# EAGLE design Incubadora_huevos (EAGLE 7.6.0)
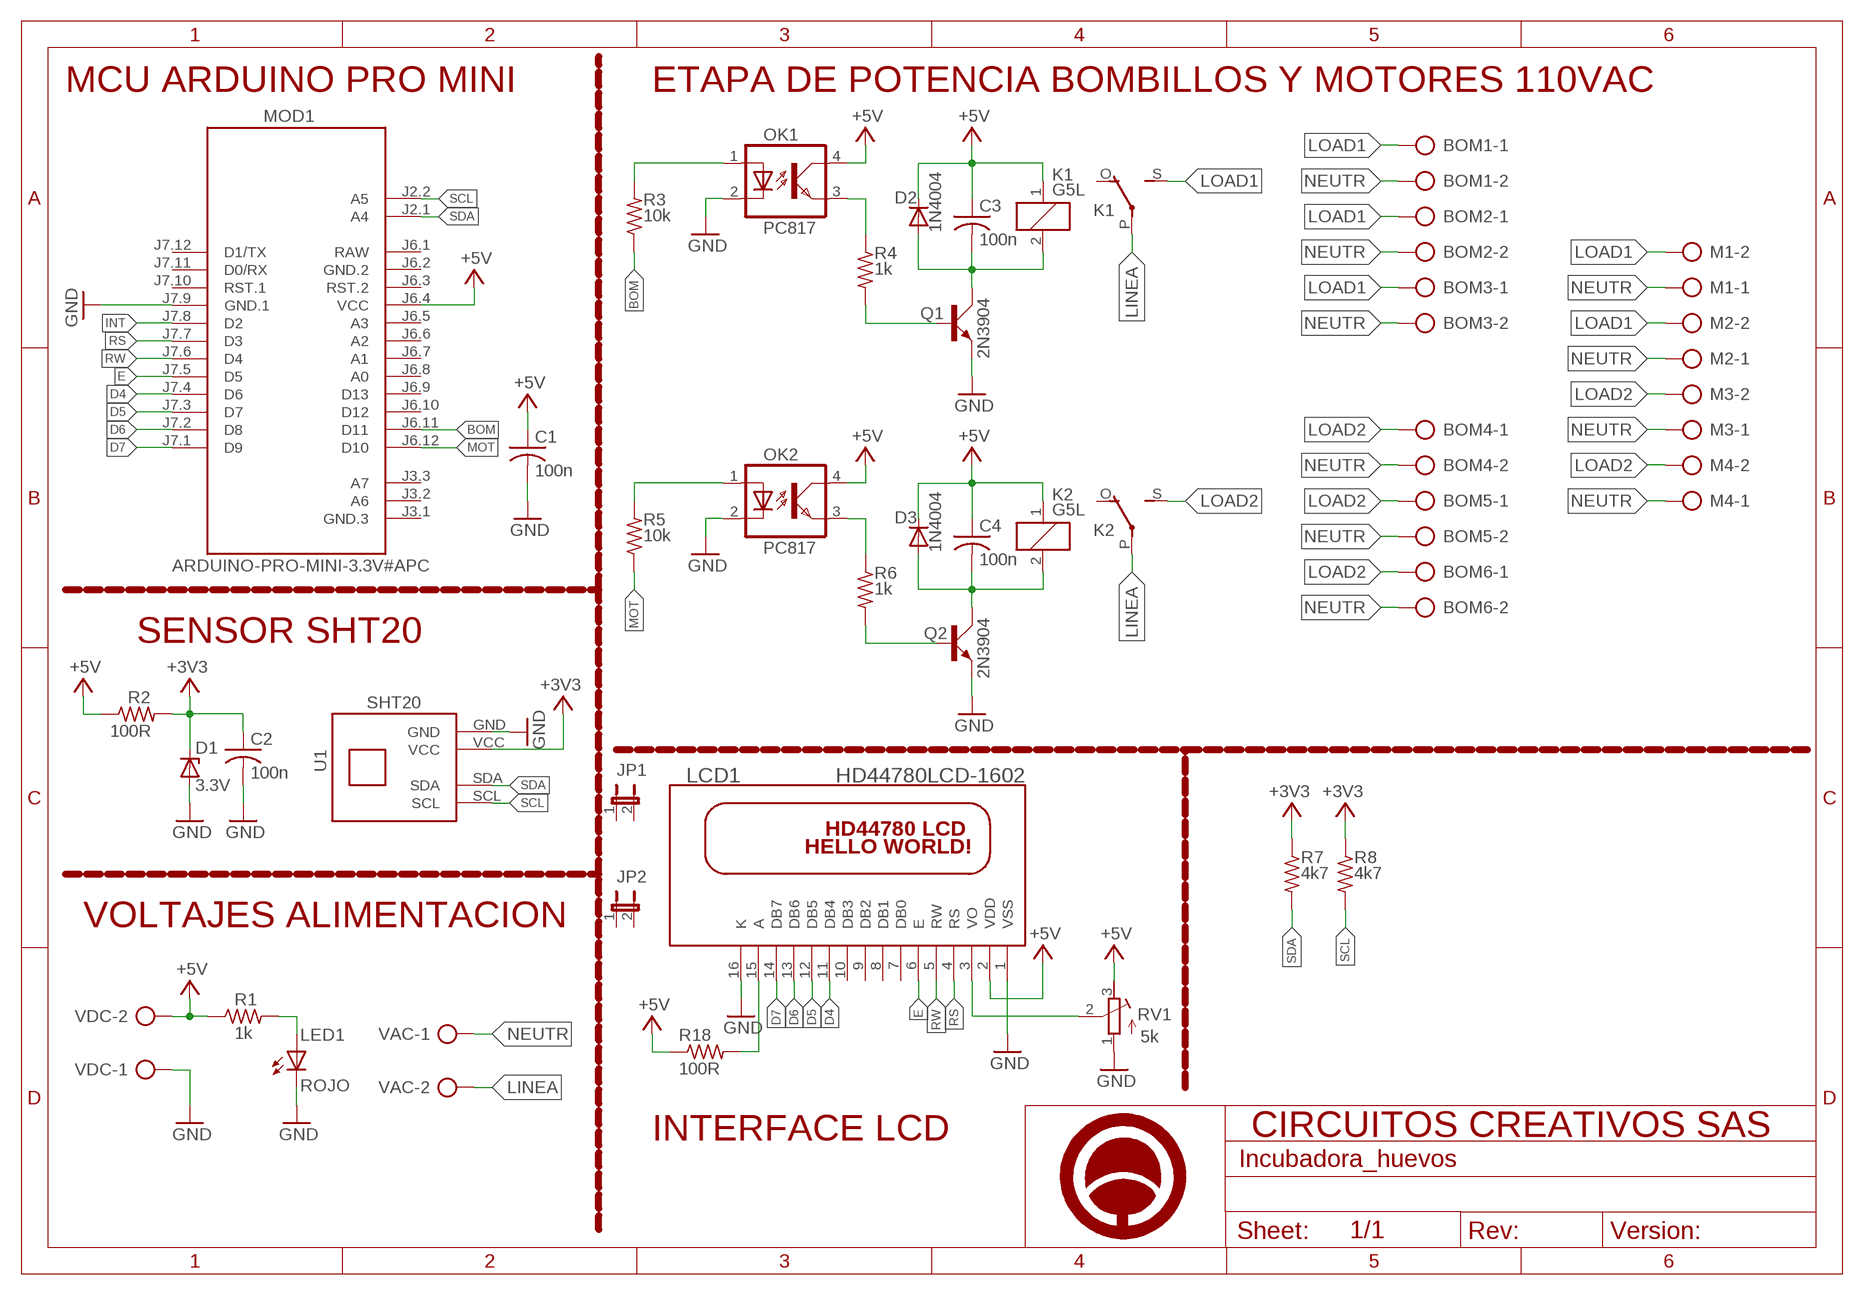
[diagram p0: schematic, sheet 1]

## Parts
BOM1  AK500/2  [AK500/2]
BOM2  AK500/2  [AK500/2]
BOM3  AK500/2  [AK500/2]
BOM4  AK500/2  [AK500/2]
BOM5  AK500/2  [AK500/2]
BOM6  AK500/2  [AK500/2]
C1  100n  C-US025-025X050  [C025-025X050]
C2  100n  C-US025-025X050  [C025-025X050]
C3  100n  C-US025-025X050  [C025-025X050]
C4  100n  C-US025-025X050  [C025-025X050]
D1  3.3V  ZENER-DIODEDO41Z10  [DO41Z10]
D2  1N4004  [DO41-10]
D3  1N4004  [DO41-10]
JP1  JP1E  [JP1]
JP2  JP1E  [JP1]
K1  G5L  [G5LE]
K2  G5L  [G5LE]
LCD1  HD44780LCD-1602  [LCD1602]
LED1  ROJO  LED3MM  [LED3MM]
M1  AK500/2  [AK500/2]
M2  AK500/2  [AK500/2]
M3  AK500/2  [AK500/2]
M4  AK500/2  [AK500/2]
MOD1  ARDUINO-PRO-MINI-3.3V#APC  [ARDUINO-PRO-MINI#APC]
OK1  PC817  [DIL04]
OK2  PC817  [DIL04]
Q1  2N3904  [TO92D]
Q2  2N3904  [TO92D]
R1  1k  R-US_0204/7  [0204/7]
R2  100R  R-US_0204/7  [0204/7]
R3  10k  R-US_0204/7  [0204/7]
R4  1k  R-US_0204/7  [0204/7]
R5  10k  R-US_0204/7  [0204/7]
R6  1k  R-US_0204/7  [0204/7]
R7  4k7  R-US_0204/7  [0204/7]
R8  4k7  R-US_0204/7  [0204/7]
R18  100R  R-US_0204/7  [0204/7]
RV1  5k  R-TRIMM3296W  [RTRIM3296W]
U1  SHT20  [SHT20]
U$1  A4_HORIZONTAL  [LOGO]
VAC  AK500/2  [AK500/2]
VDC  AK500/2  [AK500/2]

## Nets
+3V3: C2.1 D1.C R2.2 R7.1 R8.1 U1.VCC
+5V: C1.1 C3.1 C4.1 D2.C D3.C K1.1 K2.1 LCD1.2(VDD) MOD1.J6.4(VCC) OK1.4(COL) OK2.4(COL) R1.1 R2.1 R18.1 RV1.3(E) VDC.2
BOM: MOD1.J6.11(D11) R3.1
D4: LCD1.11(DB4) MOD1.J7.4(D6)
D5: LCD1.12(DB5) MOD1.J7.3(D7)
D6: LCD1.13(DB6) MOD1.J7.2(D8)
D7: LCD1.14(DB7) MOD1.J7.1(D9)
E: LCD1.6(E) MOD1.J7.5(D5)
GND: C1.2 C2.2 D1.A LCD1.1(VSS) LCD1.16(K) LED1.K(C) MOD1.J7.9(GND.1) OK1.2(C) OK2.2(C) Q1.E Q2.E RV1.1(A) U1.GND VDC.1
INT: MOD1.J7.8(D2)
LINEA: K1.P(2:P) K2.P(2:P) VAC.2
LOAD1: BOM1.1 BOM2.1 BOM3.1 K1.S(2:S) M1.2 M2.2
LOAD2: BOM4.1 BOM5.1 BOM6.1 K2.S(2:S) M3.2 M4.2
MOT: MOD1.J6.12(D10) R5.1
N$1: LED1.A R1.2
N$2: OK1.3(EMIT) R4.1
N$3: Q1.B R4.2
N$4: OK1.1(A) R3.2
N$5: C4.2 D3.A K2.2 Q2.C
N$6: OK2.3(EMIT) R6.1
N$7: Q2.B R6.2
N$8: OK2.1(A) R5.2
N$21: C3.2 D2.A K1.2 Q1.C
N$34: LCD1.3(VO) RV1.2(S)
N$46: LCD1.15(A) R18.2
NEUTR: BOM1.2 BOM2.2 BOM3.2 BOM4.2 BOM5.2 BOM6.2 M1.1 M2.1 M3.1 M4.1 VAC.1
RS: LCD1.4(RS) MOD1.J7.7(D3)
RW: LCD1.5(RW) MOD1.J7.6(D4)
SCL: MOD1.J2.2(A5) R8.2 U1.SCL
SDA: MOD1.J2.1(A4) R7.2 U1.SDA
Unconnected: JP1.1 JP1.2 JP2.1 JP2.2 K1.O(2:O) K2.O(2:O) LCD1.7(DB0) LCD1.8(DB1) LCD1.9(DB2) LCD1.10(DB3) MOD1.J3.1(GND.3) MOD1.J3.2(A6) MOD1.J3.3(A7) MOD1.J6.3(RST.2) MOD1.J6.5(A3) MOD1.J6.6(A2) MOD1.J6.7(A1) MOD1.J6.8(A0) MOD1.J6.9(D13) MOD1.J6.10(D12) MOD1.J7.10(RST.1) MOD1.J7.11(D0/RX) MOD1.J7.12(D1/TX)

## Notes on the sheet
- MCU ARDUINO PRO MINI | ETAPA DE POTENCIA BOMBILLOS Y MOTORES 110VAC
- SENSOR SHT20
- VOLTAJES ALIMENTACION
- INTERFACE LCD

## Power pins joined to a net without a drawn wire
GND.2: MOD1.J6.2(GND.2)
RAW: MOD1.J6.1(RAW)

## Library data of the parts
BOM1-BOM6 M1-M4 VAC VDC = con-ptr500:AK500/2: CONNECTOR; OC_FARNELL: unknown; OC_NEWARK: unknown
C1-C4 = rcl:C-US: CAPACITOR, American symbol
D1 = diode:ZENER-DIODE: Z-Diode
D2 D3 = adafruit:1N4004: DIODE General purpose 1N400x type rectifier (With bigger pads) http://www.ladyada.net/library/pcb/eaglelibrary.html
JP1 JP2 = jumper:JP1E: JUMPER
K1 K2 = relay:G5L: RELAY 1 x switch, 10 A/120 V AC, 8 A/30 V ADC, Omron; OC_FARNELL: unknown; OC_NEWARK: unknown
LCD1 = adafruit:HD44780LCD: HD44780 LCD Standard character type LCDs, available in sizes from 8x1 to 40x4!
LED1 = led:LED: LED OSRAM: - CHIPLED LG R971, LG N971, LY N971, LG Q971, LY Q971, LO R971, LY R971 LH N974, LH R974 LS Q976, LO Q976, LY Q976 LO Q996 - Hyper CHIPLED LW Q18S LB Q993, LB Q99A, LB R99A - SideLED LS A670, LO A670, LY A670, LG A670, LP A670 LB A673, LV A673, LT A673, LW A673 LH A674 LY A675 LS A676, LA A676, LO A676, LY A676, LW A676 LS A679, LY A679, LG A679 - Hyper Micro SIDELED® LS Y876, LA Y876, LO Y876, LY Y876 LT Y87S - SmartLED LW L88C, LW L88S LB L89C, LB L89S, LG L890 LS L89K, LO L89K, LY L89K LS L896, LA L896, LO L896, LY L896 - TOPLED LS T670, LO T670, LY T670, LG T670, LP T670 LSG T670, LSP T670, LSY T670, LOP T670, LYG T670 LG T671, LOG T671, LSG T671 LB T673, LV T673, LT T673, LW T673 LH T674 LS T676, LA T676, LO T676, LY T676, LB T676, LH T676, LSB T676, LW T676 LB T67C, LV T67C, LT T67C, LS T67K, LO T67K, LY T67K, LW E67C LS E67B, LA E67B, LO E67B, LY E67B, LB E67C, LV E67C, LT E67C LW T67C LS T679, LY T679, LG T679 LS T770, LO T770, LY T770, LG T770, LP T770 LB T773, LV T773, LT T773, LW T773 LH T774 LS E675, LA E675, LY E675, LS T675 LS T776, LA T776, LO T776, LY T776, LB T776 LHGB T686 LT T68C, LB T68C - Hyper Mini TOPLED® LB M676 - Mini TOPLED Santana® LG M470 LS M47K, LO M47K, LY M47K Source: http://www.osram.convergy.de LUXEON: - LUMILED® LXK2-PW12-R00, LXK2-PW12-S00, LXK2-PW14-U00, LXK2-PW14-V00 LXK2-PM12-R00, LXK2-PM12-S00, LXK2-PM14-U00 LXK2-PE12-Q00, LXK2-PE12-R00, LXK2-PE12-S00, LXK2-PE14-T00, LXK2-PE14-U00 LXK2-PB12-K00, LXK2-PB12-L00, LXK2-PB12-M00, LXK2-PB14-N00, LXK2-PB14-P00, LXK2-PB14-Q00 LXK2-PR12-L00, LXK2-PR12-M00, LXK2-PR14-Q00, LXK2-PR14-R00 LXK2-PD12-Q00, LXK2-PD12-R00, LXK2-PD12-S00 LXK2-PH12-R00, LXK2-PH12-S00 LXK2-PL12-P00, LXK2-PL12-Q00, LXK2-PL12-R00 Source: www.luxeon.com KINGBRIGHT: KA-3528ASYC Source: www.kingbright.com
MOD1 = DIY- comercial modules:ARDUINO-PRO-MINI-*#APC: Arduino Pro Mini (and compatible devices) with angle programming connector More details available here: https://www.arduino.cc/en/Main/ArduinoBoardProMini Click here to find device on ebay.com <http://www.ebay.com/sch/arduino+pro+mini>
OK1 OK2 = optocoupler:PC817: SHARP OPTO COUPLER; MPN: PC817X4J000F; OC_FARNELL: 9707727; OC_NEWARK: 97K7059
Q1 Q2 = transistor-small-signal:2N3904: NPN TRANSISTOR
R1-R8 R18 = rcl:R-US_: RESISTOR, American symbol
RV1 = rcl:R-TRIMM: Trimm resistor
U1 = Circuitos-Creativos-Sensores:SHT20
U$1 = Circuitos-Creativos-Estilos:A4_HORIZONTAL

## Net classes
1 PWR: width 0.305 mm, clearance 0.254 mm

## Board
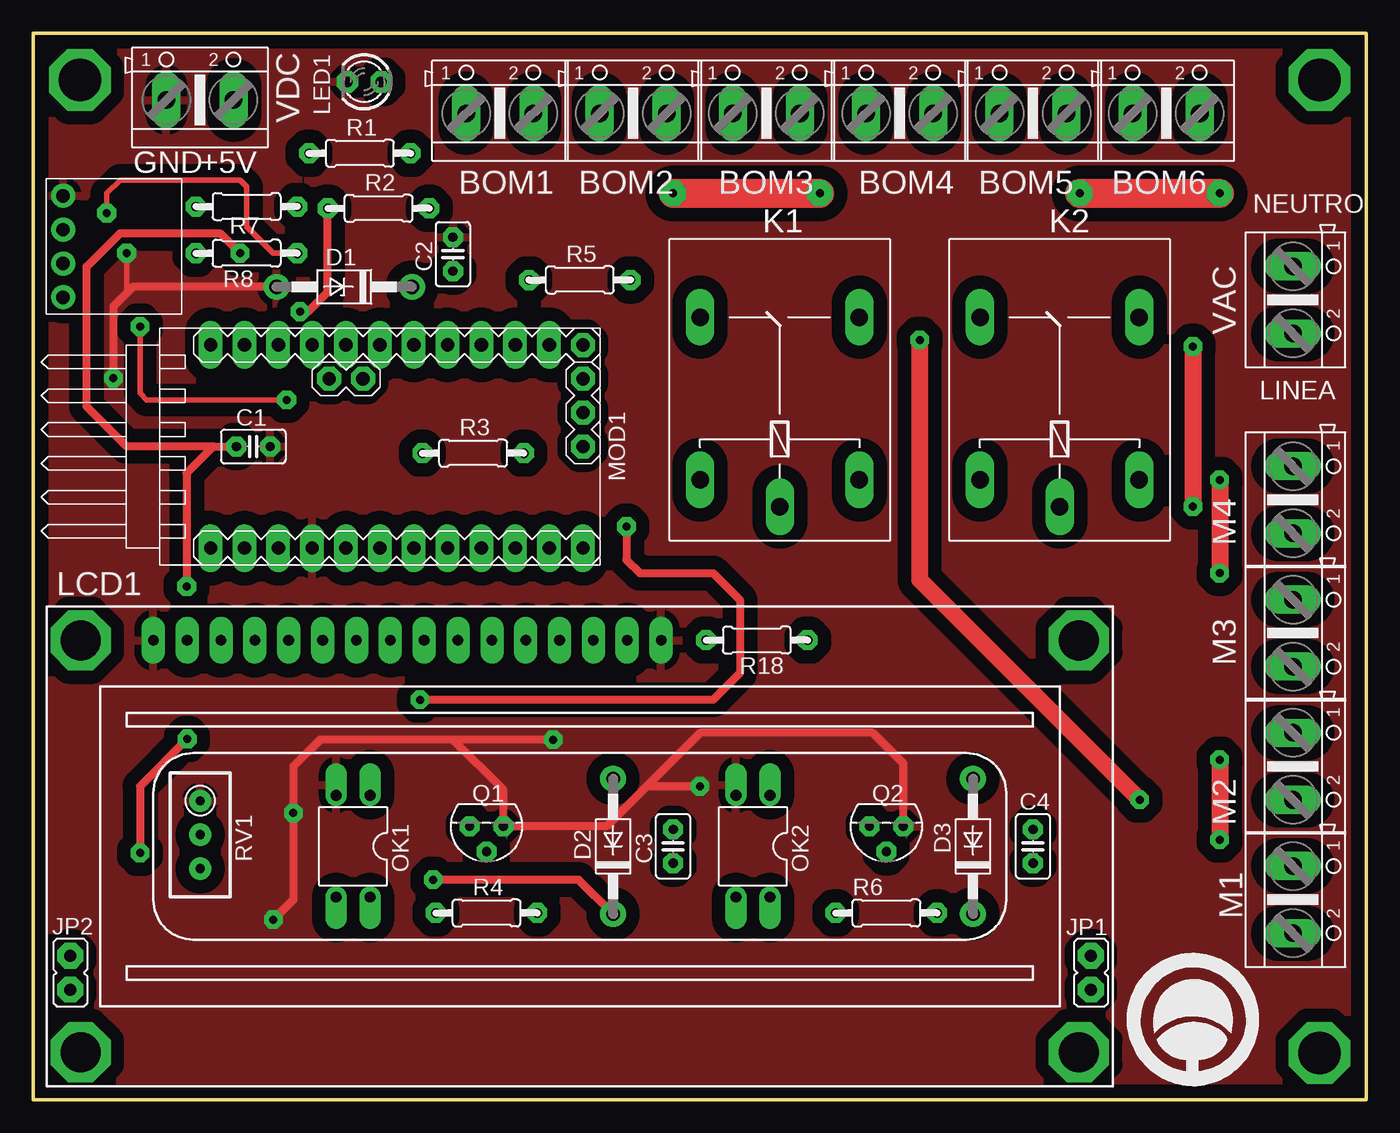
[diagram p1: board, top side]
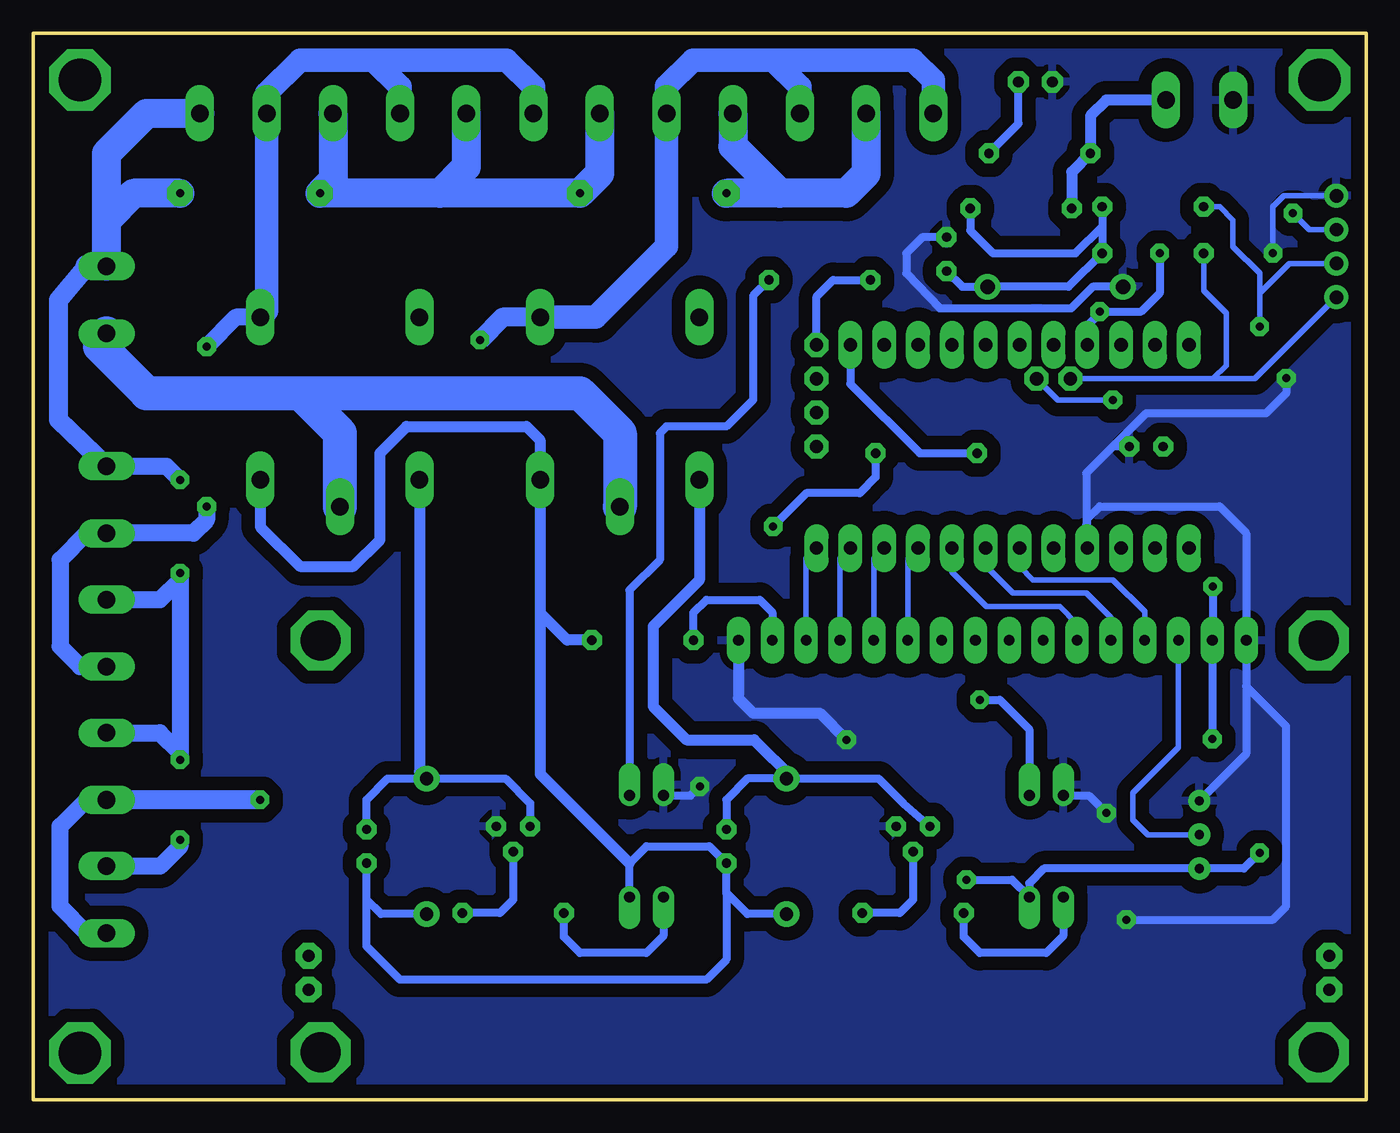
[diagram p2: board, bottom side, seen from below]

Size 100 x 80 mm. Coordinates in mm from the lower left corner, seen from the top.
Outline: 0,0 100,0 100,80 0,80 0,0
Copper layers (1*16): Top 0.035mm / dielectric 1.5mm / Bottom 0.035mm
Design rules "Circuitos_Creativos_2_capas *": minimum track width 0.4mm, minimum drill 0.6mm, track to track 10mil, track to pad 10mil, pad to pad 10mil, via to via 10mil, smd to smd 8mil, copper to edge 0.95mm, drill to drill 15mil, minimum pad ring 0.4mm, minimum via ring 0.4mm, stop-mask expansion 4mil, vias tented up to drill 0mil, thermal gap 20mil

### Footprints (pad centres in the part's own frame; a part is rotated, then mirrored left to right if it is on the bottom)
AK500/2 = drill 1.321 long: 1 -2.515,0; 2 2.515,0
C025-025X050 = drill 0.7 pad 1.422 octagon: 1 -1.27,0; 2 1.27,0
DO41Z10 = drill 1.1 pad 1.93: A 5.08,0; C -5.08,0
DO41-10 = drill 1 pad 1.93: A 5.08,0; C -5.08,0
JP1 = drill 0.9 pad 1.93 octagon: 1 0,-1.27; 2 0,1.27
G5LE = drill 1.321 long: 1 -7.493,-5.969; 2 -7.493,5.969; O 4.699,5.969; P -9.525,0; S 4.699,-5.969
LCD1602 = drill 0.8 pad 1.778 long: 1 8,33.46; 2 10.54,33.46; 3 13.08,33.46; 4 15.62,33.46; 5 18.16,33.46; 6 20.7,33.46; 7 23.24,33.46; 8 25.78,33.46; 9 28.32,33.46; 10 30.86,33.46; 11 33.4,33.46; 12 35.94,33.46; 13 38.48,33.46; 14 41.02,33.46; 15 43.56,33.46; 16 46.1,33.46 | drill 3 octagon: P1 2.54,33.46; P2 2.54,2.54; P3 77.46,2.54; P4 77.46,33.46
LED3MM = drill 0.8 pad 1.6 octagon: A -1.27,0; K 1.27,0
ARDUINO-PRO-MINI#APC = drill 1 pad 1.676 octagon: J2.1 -1.27,5.08; J2.2 -3.81,5.08 | drill 1 pad 1.778 octagon: J3.1 15.24,0; J3.2 15.24,2.54; J3.3 15.24,5.08; J6.12 15.24,7.62 | drill 1 long: J6.1 -12.7,7.62; J6.2 -10.16,7.62; J6.3 -7.62,7.62; J6.4 -5.08,7.62; J6.5 -2.54,7.62; J6.6 0,7.62; J6.7 2.54,7.62; J6.8 5.08,7.62; J6.9 7.62,7.62; J6.10 10.16,7.62; J6.11 12.7,7.62; J7.1 15.24,-7.62; J7.2 12.7,-7.62; J7.3 10.16,-7.62; J7.4 7.62,-7.62; J7.5 5.08,-7.62; J7.6 2.54,-7.62; J7.7 0,-7.62; J7.8 -2.54,-7.62; J7.9 -5.08,-7.62; J7.10 -7.62,-7.62; J7.11 -10.16,-7.62; J7.12 -12.7,-7.62
DIL04 = drill 0.813 offset: 1 -1.27,-3.81; 2 1.27,-3.81; 3 1.27,3.81; 4 -1.27,3.81
TO92D = drill 0.7 pad 1.422 octagon: B 0,1.905; C 1.27,0; E -1.27,0
0204/7 = drill 0.7 pad 1.422 octagon: 1 -3.81,0; 2 3.81,0
RTRIM3296W = drill 0.7 pad 1.676: 1 0,-2.54; 2 0,0; 3 0,2.54
SHT20 = drill 1 pad 1.778: GND -3.81,-1.27; SCL 3.81,-1.27; SDA 1.27,-1.27; VCC -1.27,-1.27

### Placement (x,y rotation side)
BOM1  35,74 0 top
BOM2  45,74 0 top
BOM3  55,74 0 top
BOM4  65,74 0 top
BOM5  75,74 0 top
BOM6  85,74 0 top
C1  16.5,49 0 top
C2  31.48,63.43 90 top
C3  48,19 90 top
C4  75,19 90 top
D1  23.33,60.98 180 top
D2  43.5,19 90 top
D3  70.5,19 90 top
JP1  79.35,9.52 0 top
JP2  2.77,9.52 0 top
K1  56,54 90 top
K2  77,54 90 top
LCD1  1,1 0 top
LED1  24.82,76.36 180 top
M1  94.5,15 270 top
M2  94.5,25 270 top
M3  94.5,35 270 top
M4  94.5,45 270 top
MOD1  26,49 0 top
OK1  24,19 180 top
OK2  54,19 180 top
Q1  34,20.5 180 top
Q2  64,20.5 180 top
R1  24.5,71 0 top
R2  25.9,66.87 0 top
R3  33,48.5 0 top
R4  34,14 0 top
R5  41,61.5 0 top
R6  64,14 0 top
R7  16,67 180 top
R8  16,63.5 180 top
R18  54.28,34.47 180 top
RV1  12.52,19.87 180 top
U1  3.5,64 270 top
U$1  87,6 0 top
VAC  94.5,60 270 top
VDC  12.5,75 0 top

### Tracks (layer width: path | path; a pad name or v marks a point on that pad's centre or on a via)
+3V3  (via drill 0.6)
  Top 0.406: v5.5,66.5 5.5,68 6.5,69 15.5,69 16,68.5 16,65.5 18,63.5 R8.1
  Bottom 0.406: U1.VCC 4.27,65.27 v5.5,66.5
  Bottom 0.61: C2.1 30.3,60.98 D1.C 22.33,60.98 R8.1 19.81,65.5 | R7.1 19.81,65.5 | R2.2 29.71,65.21 28,63.5 21.81,63.5 19.81,65.5
+5V  (via drill 0.6, 0.6 pad 1.42)
  Top 0.61: v11.54,27.04 8,23.5 v8,18.5 | 13.5,49 11.5,47 v11.5,38.5 | D2.C 40.92,16.5 v30,16.5 | 13.5,49 7,49 4,52 4,62.5 6.5,65 14,65 v15.5,63.5 | R2.1 22.09,60.59 20.62,59.12 v20,59.12 | 13.5,49 C1.1
  Bottom 0.61: v11.54,27.04 LCD1.2 11.5,34.5 v11.5,38.5 | v8,18.5 9.17,17.33 RV1.3 24.17,17.33 25.27,16.23 OK1.4 26.58,16.5 v30,16.5 | D2.C 46.42,13.92 48,15.5 | 48,15.5 C3.1 49.27,19 54,19 55.27,17.73 OK2.4 | D3.C 73.92,13.92 75,15 | 75,15 C4.1 | 48,15.5 48,10.5 49.5,9 72.5,9 75,11.5 75,15 | v15.5,63.5 15.5,60.5 16.88,59.12 v20,59.12 20,59 20.92,58.08 MOD1.J6.4
  Bottom 0.813: VDC.2 19.5,75 20.69,73.81 R1.1 22.09,69.6 R2.1 | K1.1 61.97,46 | 61.97,46 61.97,36.5 | 61.97,36.5 61.97,24.43 55.27,17.73 | R18.1 59.94,34.47 61.97,36.5 | K2.1 82.97,42.97 80,40 76,40 74,42 74,48.5 72,50.5 63,50.5 62,49.5 62,46.03 61.97,46
BOM
  Bottom 0.61: MOD1.J6.11 38.7,53.7 33.5,48.5 R3.1
D4
  Bottom 0.406: MOD1.J7.4 34.4,40.6 LCD1.11
D5
  Bottom 0.406: MOD1.J7.3 36.94,40.6 LCD1.12
D6
  Bottom 0.406: MOD1.J7.2 39.48,40.6 LCD1.13
D7
  Bottom 0.406: MOD1.J7.1 42.02,40.6 LCD1.14
E
  Bottom 0.406: MOD1.J7.5 31.08,39.58 28.5,37 23,37 21.7,35.7 LCD1.6
GND  (via drill 0.6)
  Top 0.406: v7,63.5 7,60.5
  Top 0.61: v18,13.5 19.5,15 v19.5,21.5 19.5,25 21.5,27 31.5,27 | v50,23.5 46,23.5 | 46,23.5 43,20.5 Q1.E 35.27,23.23 31.5,27 | v39,27 31.5,27 | Q2.E 65.27,25.23 63,27.5 50,27.5 46,23.5 | D1.A 7.48,60.98 7,60.5 6,59.5 v6,54.12
  Bottom 0.406: U1.GND 6.19,67.81 7,67 v7,63.5
  Bottom 0.61: 9,31 LCD1.1 9,42.5 11,44.5 20,44.5 20.92,43.58 20.92,43 | 9,31 9,25.93 RV1.1 | MOD1.J7.9 20.92,43 | C1.2 19,49 | 19,49 21,47 21,43.08 20.92,43 | OK1.2 20.81,22.81 v19.5,21.5 | v18,13.5 7,13.5 6,14.5 6,28 9,31 | OK2.2 50.69,22.81 v50,23.5 | D1.A 20.52,60.98 22.12,59.38 32,59.38 34.5,62 34.5,63.5 33.3,64.7 C2.2 | 19,49 16.5,51.5 7.5,51.5 6,53 v6,54.12
  Bottom 0.813: LCD1.16 47.1,30.1 46,29 41,29 v39,27
  pour Top (isolate 1.016): -2,-2 102,-2 102,82 -2,82
  pour Bottom (isolate 1.016): -1,-1 101,-1 101,81 -1,81
LINEA
  Bottom 2.54: 80,53 59,53 56,50 K1.P | K2.P 77,50 80,53 | VAC.2 95,56.5 91.5,53 80,53
LOAD1  (via drill 0.6)
  Top 1.27: v83,22.5 66.5,39 v66.5,57
  Bottom 1.27: M1.2 95.98,12.48 98,14.5 98,20.5 96,22.5 95,22.5 94.98,22.48 M2.2
  Bottom 1.422: K1.S 64.8,58.7 v66.5,57 | v83,22.5 94.48,22.5 M2.2
  Bottom 1.778: K1.S 57.8,58.7 52.48,64.02 BOM3.1 52.48,76.02 50.5,78 44.5,78 | BOM1.1 32.48,76.48 34,78 44.5,78 | BOM2.1 42.48,75.98 44.5,78
LOAD2  (via drill 0.6)
  Top 1.27: v87,56.5 v87,44.5
  Bottom 1.27: M3.2 96.48,32.48 98,34 98,40.5 96.02,42.48 M4.2 94.98,42.5 88,42.5 87,43.5 v87,44.5 | K2.S 84.8,58.7 v87,56.5
  Bottom 1.778: K2.S 82.48,59.18 BOM6.1 82.48,75.52 80,78 74.5,78 | BOM4.1 62.48,75.98 64.5,78 74.5,78 | BOM5.1 72.48,75.98 74.5,78
MOT
  Bottom 0.61: MOD1.J6.12 41.24,60.26 40,61.5 R5.1
N$1
  Bottom 0.61: R1.2 26.09,73.22 LED1.A
N$2
  Bottom 0.61: OK1.3 22.73,12.27 24,11 29,11 30.19,12.19 R4.1
N$3
  Bottom 0.61: Q1.B 34,15 35,14 R4.2
N$4  (via drill 0.6)
  Top 0.61: v44.5,43 44.5,40.5 45.5,39.5 51,39.5 53,37.5 53,32 51,30 v29,30
  Bottom 0.61: R3.2 36.81,46.69 38,45.5 42,45.5 v44.5,43 | v29,30 27.5,30 25.27,27.77 OK1.1
N$5
  Bottom 0.61: Q2.C 62.73,22.23 64.58,24.08 D3.A 73.42,24.08 75,22.5 C4.2
  Bottom 0.813: K2.2 71.03,24.61 D3.A
N$6
  Bottom 0.61: OK2.3 52.73,12.27 54,11 59,11 60.19,12.19 R6.1
N$7
  Bottom 0.61: Q2.B 64,15 65,14 R6.2
N$8
  Bottom 0.61: R5.2 46,60.31 46,52.5 48,50.5 52.5,50.5 53,50 53,40.5 55.27,38.23 OK2.1
N$21
  Bottom 0.61: Q1.C 34.73,22.23 36.58,24.08 43,24.08 D2.A 46.42,24.08 48,22.5 C3.2
  Bottom 0.813: K1.2 50.03,38.97 53.5,35.5 53.5,29.5 51,27 45.92,27 43,24.08
N$34
  Bottom 0.406: LCD1.3 14.08,26.42 17.5,23 17.5,21 16.37,19.87 RV1.2
N$46
  Bottom 0.61: R18.2 50.47,36.53 49.5,37.5 45.5,37.5 44.56,36.56 LCD1.15
NEUTR  (via drill 0.6, 0.6 pad 1.93)
  Top 1.27: v89,46.5 v89,39.5 | v89,25.5 v89,19.5
  Top 2.184: v78.5,68 v89,68 | v48,68 v59,68
  Bottom 1.27: M4.1 90.02,47.52 v89,46.5 | v89,39.5 89,39 | 89,39 89,26 | 89,26 v89,25.5 | v89,19.5 89,19 90.5,17.5 94.48,17.5 M1.1 | M2.1 90.52,27.52 89,26 | M3.1 90.48,37.52 89,39
  Bottom 1.422: 95.98,62.52 98.12,60 98.12,51.02 M4.1
  Bottom 1.676: VAC.1 95.98,62.52
  Bottom 2.184: VAC.1 94.5,66 | 94.5,66 94.5,71 91.5,74 BOM6.2 | BOM5.2 77.52,68.98 v78.5,68 69.5,68 | v89,68 92.5,68 94.5,66 | BOM4.2 67.52,69.98 69.5,68 | BOM3.2 57.52,69.48 v59,68 69.5,68 | BOM1.2 37.52,69.48 39,68 44,68 | 44,68 v48,68 | BOM2.2 47.52,71.52 44,68
RS
  Bottom 0.406: MOD1.J7.7 26,40 25,39 19,39 16.62,36.62 LCD1.4
RW
  Bottom 0.406: MOD1.J7.6 28.54,40.04 26.5,38 21,38 19.16,36.16 LCD1.5
SCL
  Bottom 0.406: MOD1.J2.2 11.5,54.08 | 11.5,54.08 8.34,54.08 U1.SCL | R8.2 12.19,60.69 10.5,59 10.5,55.08 11.5,54.08
SDA  (via drill 0.6 pad 1.42)
  Top 0.406: v8,58 8,53 8.5,52.5 v19,52.5
  Bottom 0.406: v19,52.5 23.15,52.5 MOD1.J2.1 | R7.2 11,67 10,66 10,64 8,62 8,60.5 | 8,60.5 v8,58 | U1.SDA 5.77,62.73 8,60.5
TOR1  (via drill 3.2 pad 3.81)
  other vias: 3.5,76.5
TOR2  (via drill 3.2 pad 3.81)
  other vias: 96.5,3.5
TOR3  (via drill 3.2 pad 3.81)
  other vias: 96.5,76.5

### Text on the board
tPlace: GND | +5V | NEUTRO | LINEA